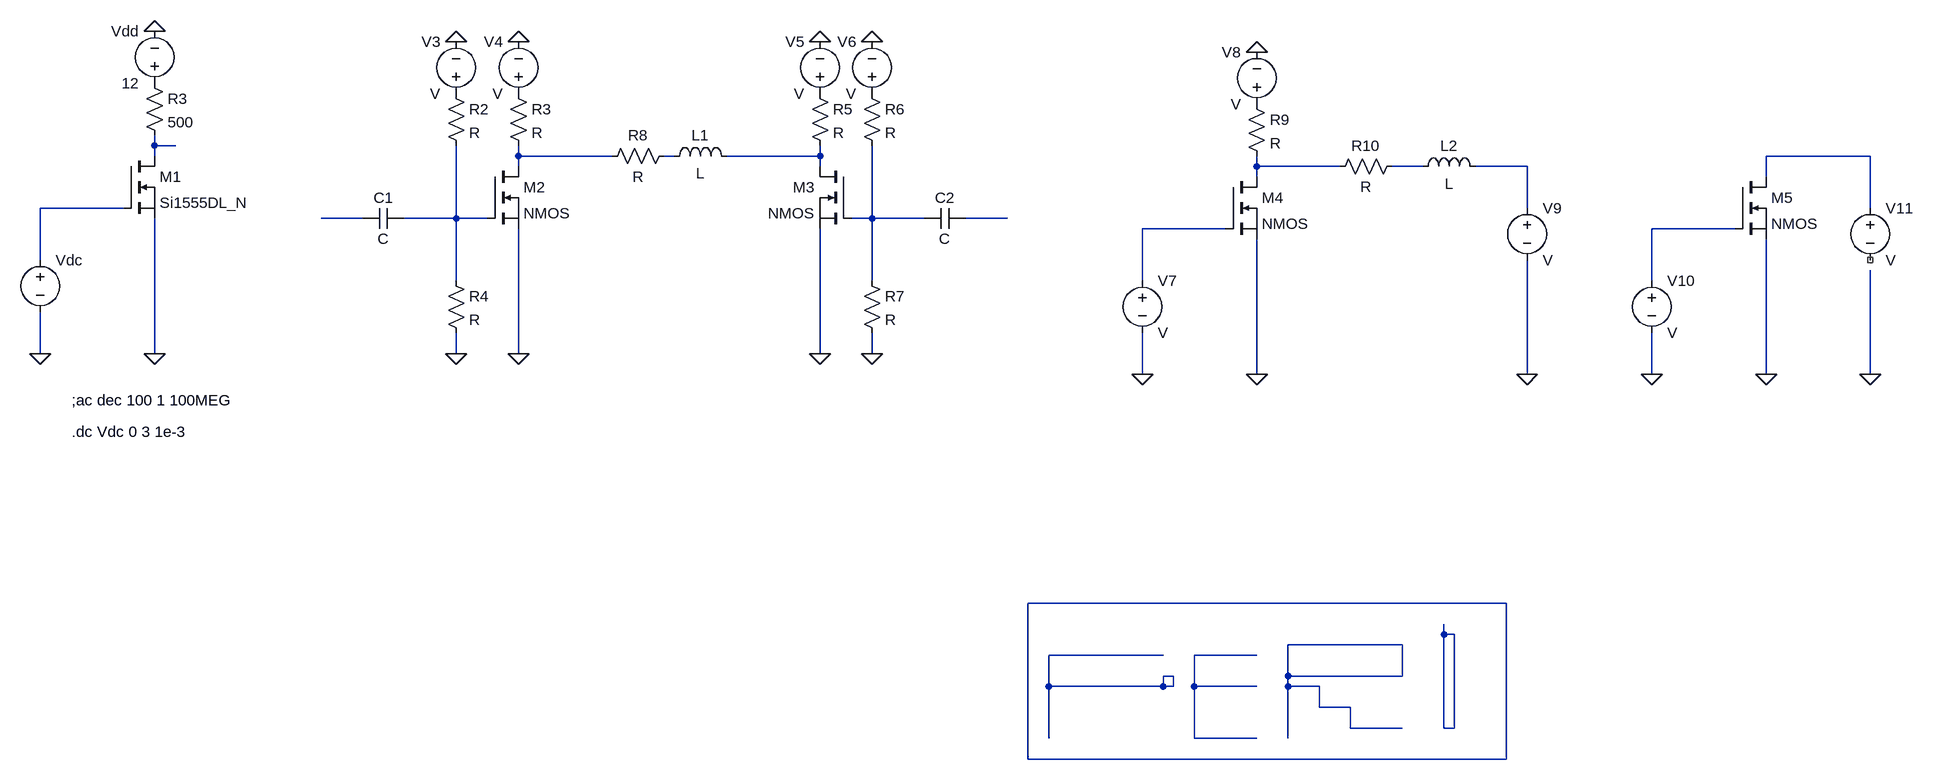
[diagram p0: schematic Draft.Zadanie.asc]
Draft.Zadanie.asc, the LTspice schematic file:
Version 4
SHEET 1 2764 1060
WIRE 48 112 48 96
WIRE 80 112 48 112
WIRE 48 128 48 112
WIRE 608 128 608 112
WIRE 752 128 608 128
WIRE 848 128 832 128
WIRE 1072 128 1072 112
WIRE 1072 128 928 128
WIRE 2688 128 2528 128
WIRE 608 144 608 128
WIRE 1072 144 1072 128
WIRE 1744 144 1744 128
WIRE 1872 144 1744 144
WIRE 2000 144 1952 144
WIRE 2160 144 2080 144
WIRE 1744 160 1744 144
WIRE 2528 160 2528 128
WIRE 0 208 -128 208
WIRE 2160 208 2160 144
WIRE 2688 208 2688 128
WIRE 368 224 304 224
WIRE 512 224 512 112
WIRE 512 224 432 224
WIRE 560 224 512 224
WIRE 1152 224 1152 112
WIRE 1152 224 1120 224
WIRE 1232 224 1152 224
WIRE 1360 224 1296 224
WIRE 1696 240 1568 240
WIRE 2480 240 2352 240
WIRE -128 288 -128 208
WIRE 512 320 512 224
WIRE 1152 320 1152 224
WIRE 1568 320 1568 240
WIRE 2352 320 2352 240
WIRE -128 432 -128 368
WIRE 48 432 48 224
WIRE 512 432 512 400
WIRE 608 432 608 240
WIRE 1072 432 1072 240
WIRE 1152 432 1152 400
WIRE 1568 464 1568 400
WIRE 1744 464 1744 256
WIRE 2160 464 2160 288
WIRE 2352 464 2352 400
WIRE 2528 464 2528 256
WIRE 2688 464 2688 304
WIRE 2128 816 1392 816
WIRE 2032 864 2032 848
WIRE 2048 864 2032 864
WIRE 1968 880 1792 880
WIRE 1600 896 1424 896
WIRE 1744 896 1648 896
WIRE 1616 928 1600 928
WIRE 1792 928 1792 880
WIRE 1968 928 1968 880
WIRE 1968 928 1792 928
WIRE 1424 944 1424 896
WIRE 1600 944 1600 928
WIRE 1600 944 1424 944
WIRE 1616 944 1616 928
WIRE 1616 944 1600 944
WIRE 1648 944 1648 896
WIRE 1744 944 1648 944
WIRE 1792 944 1792 928
WIRE 1840 944 1792 944
WIRE 1840 976 1840 944
WIRE 1888 976 1840 976
WIRE 1888 1008 1888 976
WIRE 1968 1008 1888 1008
WIRE 2032 1008 2032 864
WIRE 2048 1008 2048 864
WIRE 2048 1008 2032 1008
WIRE 1424 1024 1424 944
WIRE 1648 1024 1648 944
WIRE 1744 1024 1648 1024
WIRE 1792 1024 1792 944
WIRE 1392 1056 1392 816
WIRE 2128 1056 2128 816
WIRE 2128 1056 1392 1056
FLAG -128 432 0
FLAG 48 432 0
FLAG 48 -64 0
FLAG 512 432 0
FLAG 1072 432 0
FLAG 1152 432 0
FLAG 608 432 0
FLAG 1568 464 0
FLAG 1744 464 0
FLAG 1744 -32 0
FLAG 2160 464 0
FLAG 2352 464 0
FLAG 2528 464 0
FLAG 2688 464 0
FLAG 512 -48 0
FLAG 608 -48 0
FLAG 1072 -48 0
FLAG 1152 -48 0
SYMBOL voltage -128 272 R0
WINDOW 123 0 0 Left 2
WINDOW 39 0 0 Left 2
SYMATTR InstName Vdc
SYMATTR Value ""
SYMBOL res 32 0 R0
SYMATTR InstName R3
SYMATTR Value 500
SYMBOL nmos 0 128 R0
SYMATTR InstName M1
SYMATTR Value Si1555DL_N
SYMBOL voltage 48 32 R180
WINDOW 0 24 96 Left 2
WINDOW 3 24 16 Left 2
WINDOW 123 0 0 Left 2
WINDOW 39 0 0 Left 2
SYMATTR InstName Vdd
SYMATTR Value 12
SYMBOL cap 432 208 R90
WINDOW 0 0 32 VBottom 2
WINDOW 3 32 32 VTop 2
SYMATTR InstName C1
SYMBOL res 496 16 R0
SYMATTR InstName R2
SYMBOL res 592 16 R0
SYMATTR InstName R3
SYMBOL res 496 304 R0
SYMATTR InstName R4
SYMBOL res 1056 16 R0
SYMATTR InstName R5
SYMBOL res 1136 16 R0
SYMATTR InstName R6
SYMBOL res 1136 304 R0
SYMATTR InstName R7
SYMBOL nmos 560 144 R0
SYMATTR InstName M2
SYMBOL res 848 112 R90
WINDOW 0 0 56 VBottom 2
WINDOW 3 32 56 VTop 2
SYMATTR InstName R8
SYMBOL ind 832 144 R270
WINDOW 0 32 56 VTop 2
WINDOW 3 5 56 VBottom 2
SYMATTR InstName L1
SYMBOL voltage 512 48 R180
WINDOW 0 24 96 Left 2
WINDOW 3 24 16 Left 2
SYMATTR InstName V3
SYMBOL voltage 608 48 R180
WINDOW 0 24 96 Left 2
WINDOW 3 24 16 Left 2
SYMATTR InstName V4
SYMBOL voltage 1072 48 R180
WINDOW 0 24 96 Left 2
WINDOW 3 24 16 Left 2
SYMATTR InstName V5
SYMBOL voltage 1152 48 R180
WINDOW 0 24 96 Left 2
WINDOW 3 24 16 Left 2
SYMATTR InstName V6
SYMBOL nmos 1120 144 M0
SYMATTR InstName M3
SYMBOL cap 1232 240 R270
WINDOW 0 32 32 VTop 2
WINDOW 3 0 32 VBottom 2
SYMATTR InstName C2
SYMBOL voltage 1568 304 R0
SYMATTR InstName V7
SYMBOL res 1728 32 R0
SYMATTR InstName R9
SYMBOL nmos 1696 160 R0
SYMATTR InstName M4
SYMBOL voltage 1744 64 R180
WINDOW 0 24 96 Left 2
WINDOW 3 24 16 Left 2
SYMATTR InstName V8
SYMBOL res 1856 160 R270
WINDOW 0 32 56 VTop 2
WINDOW 3 0 56 VBottom 2
SYMATTR InstName R10
SYMBOL ind 1984 160 R270
WINDOW 0 32 56 VTop 2
WINDOW 3 5 56 VBottom 2
SYMATTR InstName L2
SYMBOL voltage 2160 192 R0
SYMATTR InstName V9
SYMBOL voltage 2352 304 R0
SYMATTR InstName V10
SYMBOL nmos 2480 160 R0
SYMATTR InstName M5
SYMBOL voltage 2688 192 R0
SYMATTR InstName V11
TEXT -80 504 Left 2 !;ac dec 100 1 100MEG
TEXT -80 552 Left 2 !.dc Vdc 0 3 1e-3

The netlist it stands for:
* Draft.Zadanie.asc
Vdc N009 0
R3 P001 N001 500
M1 N001 N009 0 0 Si1555DL_N
Vdd P001 0 12
C1 N011 N010 C
R2 P002 N011 R
R3 P003 N002 R
R4 N011 0 R
R5 P004 N004 R
R6 P005 N012 R
R7 N012 0 R
M2 N002 N011 0 0 NMOS
R8 N003 N002 R
L1 N003 N004 L
V3 P002 0 V
V4 P003 0 V
V5 P004 0 V
V6 P005 0 V
M3 N004 N012 0 0 NMOS
C2 N012 N013 C
V7 N014 0 V
R9 P006 N006 R
M4 N006 N014 0 0 NMOS
V8 P006 0 V
R10 N006 N007 R
L2 N007 N008 L
V9 N008 0 V
V10 N015 0 V
M5 N005 N015 0 0 NMOS
V11 N005 NC_01 V
.model NMOS NMOS
.model PMOS PMOS
.lib standard.mos
;ac dec 100 1 100MEG
.dc Vdc 0 3 1e-3
.backanno
.end